# Altium schematic sheet PWR-Buck-Boost 2V to 5V.SchDoc
size Letter
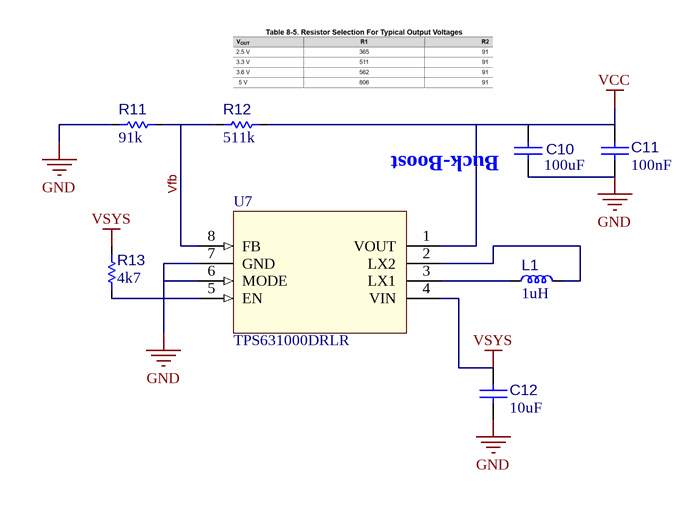
[diagram p0: PWR-Buck-Boost 2V to 5V.SchDoc]

## Parts
C10  value 100uF  [C_3216[1206]]  (hidden comment: Cap 100uF 1206)
C11  value 100nF  [C_1005[0402]]  (hidden comment: Cap 100nF 0402)
C12  value 10uF  [C_2012[0805]]  (hidden comment: Cap 10uF 0805)
L1  value 1uH  [L_3030[1212]]  (hidden comment: Ind 1UH 2.75A 51mOHM SMD)
R11  value 91k  [R_1005[0402]]  (hidden comment: Res 91k 1% 0402)
R12  value 511k  [R_1005[0402]]  (hidden comment: Res 511k 1% 0402)
R13  value 4k7  [R_1005[0402]]  (hidden comment: Res 4k7 1% 0402)
U7  TPS631000DRLR  [U_SOT583_50P210X120X60-8]

## Nets
GND: C10.1 C11.1 C12.1 R11.2 U7.6(MODE) U7.7(GND)
VCC: C10.2 C11.2 R12.2 U7.1(VOUT)
VSYS: C12.2 R13.2 U7.4(VIN)
Vfb: R11.1 R12.1 U7.8(FB)
NetL1_1: L1.1 U7.3(LX1)
NetL1_2: L1.2 U7.2(LX2)
NetR13_1: R13.1 U7.5(EN)

## Notes on the sheet
- (near R12) Buck-Boost

## Library data of the parts
C10 = CAP005: Capacitor type 1; Manufacturer 1: Murata; Manufacturer Part Number 1: GRM31CR61A107MEA8L; LibRef: CAP005; CEGEP: KCOND04SM; Tolerance: 20%; Rated Voltage: 10V; Dielectric: X5R; Supplier 1: LCSC; Supplier Part Number 1: C883598; Mounting Technology: SMT
C11 = CAP001: Capacitor type 1; Manufacturer 1: Taiyo Yuden; Manufacturer Part Number 1: UMK105B7104KV-FR; LibRef: CAP001; CEGEP: KCOND01SM; Tolerance: 10%; Rated Voltage: 50V; Dielectric: X7R; Supplier 1: LCSC; Supplier Part Number 1: C2167491; Mounting Technology: SMT
C12 = CAP004: Capacitor type 1; Manufacturer 1: Samsung; Manufacturer Part Number 1: CL21A106KAYNNNE; LibRef: CAP004; CEGEP: KCOND03SM; Tolerance: 10%; Rated Voltage: 25V; Dielectric: X5R; Supplier 1: LCSC; Supplier Part Number 1: C15850; Mounting Technology: SMT
L1 = IND001: Inductor type 1; Manufacturer 1: Murata Electronics; Manufacturer Part Number 1: LQH3NPN1R0MMEL; LibRef: IND001; CEGEP: KPTSO09; Tolerance: 0,2; DCR: 0.025R; Saturation Current: 2.3A; Supplier 1: LCSC; Supplier Part Number 1: C703777; Mounting Technology: SMT
R11 = RES011: Resistor type 1; Manufacturer 1: Panasonic; Manufacturer Part Number 1: ERJ-2RKF9102X; LibRef: RES011; Puissance: 1/16W; Max Working Voltage: 50V; Tolerance: 1%; Supplier 1: LCSC; Supplier Part Number 1: C413106; Mounting Technology: SMT
R12 = RES012: Resistor type 1; Manufacturer 1: Yageo; Manufacturer Part Number 1: RC0402FR-07511KL; LibRef: RES012; Code CEGEP: RES511KSM; Puissance: 1/16W; Max Working Voltage: 50V; Tolerance: 1%; Mounting Technology: SMT; Supplier 1: LCSC; Supplier Part Number 1: C163461
R13 = RES007: Resistor type 1; Manufacturer 1: Panasonic; Manufacturer Part Number 1: ERJ-2RKF4701X; LibRef: RES007; Puissance: 1/16W; Max Working Voltage: 50V; Tolerance: 1%; Supplier 1: LCSC; Supplier Part Number 1: C400631; Mounting Technology: SMT
U7 = U_TPS631000DRLR: buck-boost converter 1.5-A output current,; Manufacturer 1: Texas Instruments; Manufacturer Part Number 1: TPS631000DRLR; Supplier 1: LCSC; Supplier 2: Digikey; Supplier Part Number 1: C5219190; Supplier Part Number 2: 296-TPS631000DRLRCT-ND; Mounting Technology: SMT